# EAGLE board PP-Rev2 (EAGLE 6.5.0)
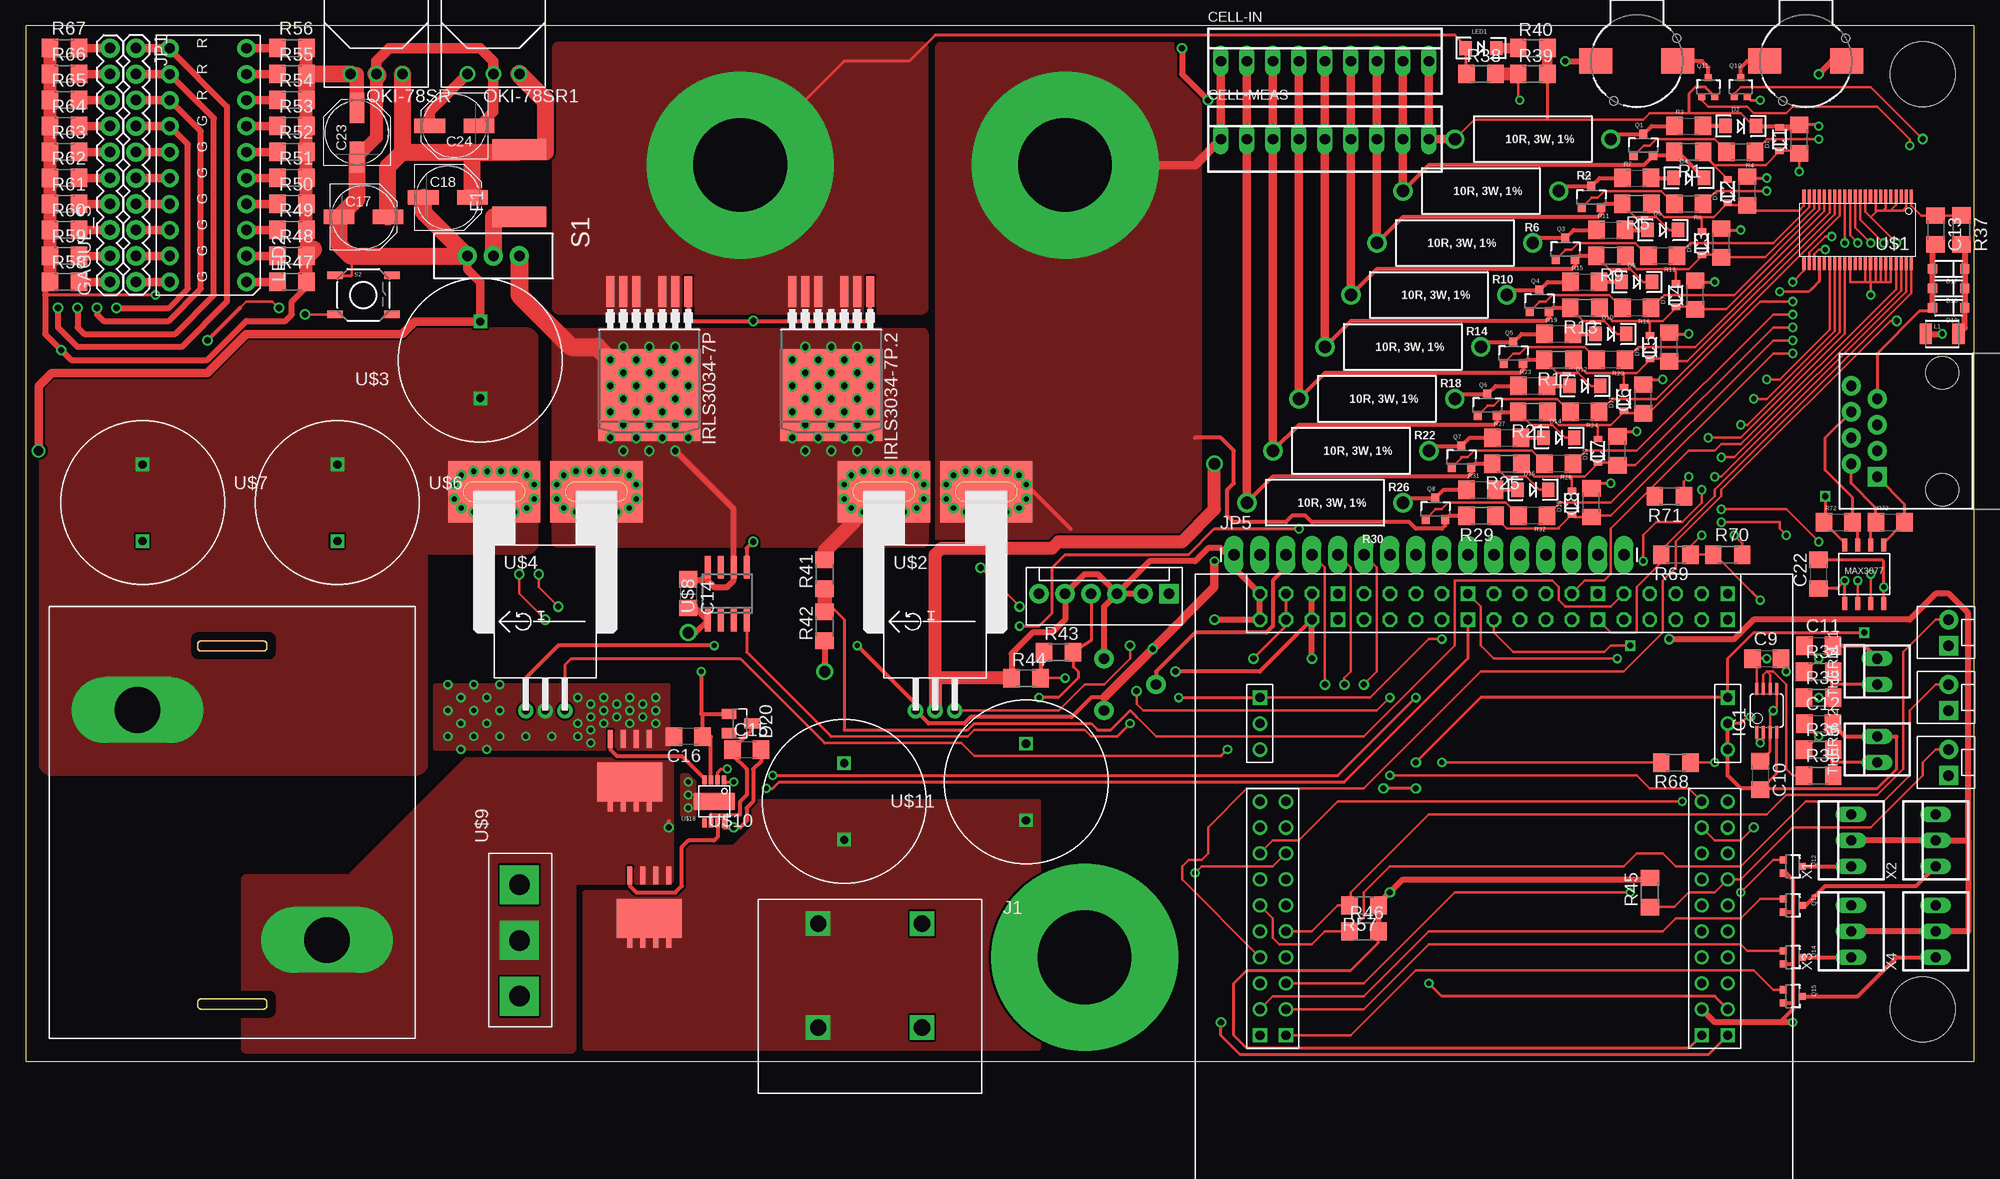
[diagram p2: board, top side]
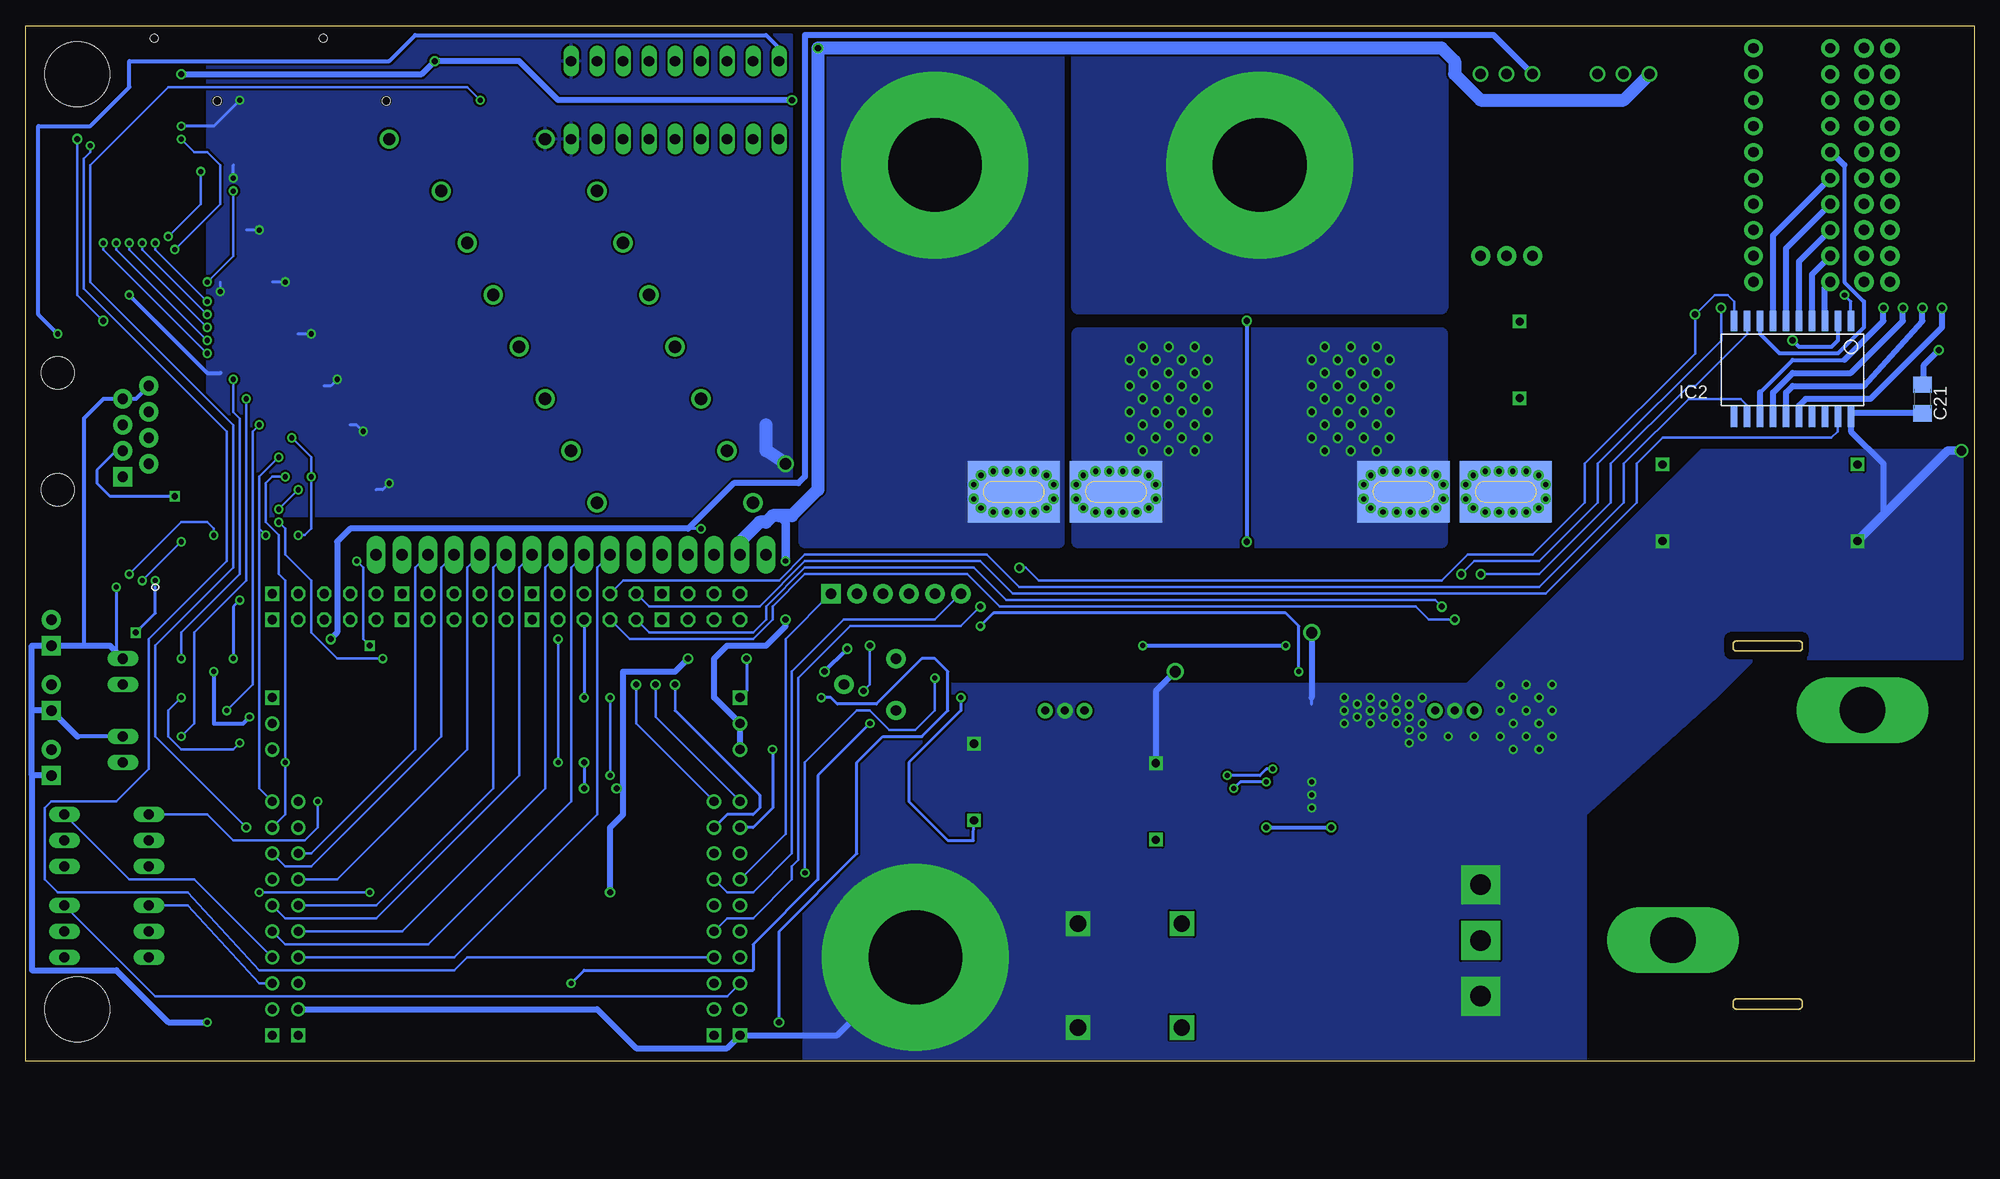
[diagram p3: board, bottom side, seen from below]

Size 190.48 x 101.27 mm. Coordinates in mm from the lower left corner, seen from the top.
Outline: 0,0 190.48,0 190.48,101.27 0,101.27 0,0
Copper layers (1*16): Top 0.035mm / dielectric 1.5mm / Bottom 0.035mm
Design rules "default *": minimum track width 10mil, minimum drill 10mil, track to track 4mil, track to pad 5mil, pad to pad 5mil, via to via 8mil, smd to smd 5mil, copper to edge 5mil, drill to drill 8mil, minimum pad ring 10mil, minimum via ring 8mil, stop-mask expansion 4mil, vias tented up to drill 0mil, thermal gap 10mil
Net classes: 0 default: clearance 0.205 mm
Holes 6.35 mm at 185.42,96.52 185.42,5.08

## Footprints (pad centres in the part's own frame; a part is rotated, then mirrored left to right if it is on the bottom)
BUZZER-CCV = smd 3.2 x 2.5: + 4,0; - -4,0 | hole 0.8: -3.9,-2.25; 2.25,3.9
C1206 = smd 1.6 x 1.8: 1 -1.4,0; 2 1.4,0
PANASONIC_D = smd 3 x 1.4: + 2.4,0; - -2.4,0
22-23-2091 = drill 1 long: 1 -10.16,0; 2 -7.62,0; 3 -5.08,0; 4 -2.54,0; 5 0,0; 6 2.54,0; 7 5.08,0; 8 7.62,0; 9 10.16,0
SOD-323 = smd 0.63 x 0.83: A 1.15,0; C -1.15,0
LED-1206 = smd 1.2 x 1.4: A -1.5,0; C 1.5,0
SOD-123 = smd 0.9 x 0.95: A 1.575,0; C -1.575,0
SOT23 = smd 1 x 1.4: 1 -0.95,-1.1; 2 0.95,-1.1; 3 0,1.1
2920 = smd 2 x 5.3: P$1 0,0; P$2 6.6,0
1X10 = drill 1.016 pad 1.88: 1 0,0; 2 2.54,0; 3 5.08,0; 4 7.62,0; 5 10.16,0; 6 12.7,0; 7 15.24,0; 8 17.78,0; 9 20.32,0; 10 22.86,0
MOLEX-1X2 = drill 1.016 pad 1.88 square: 1 0,0 | drill 1.016 pad 1.88: 2 2.54,0
MSOP08 = smd 0.3 x 1.2: 1 -0.976,-2.113; 2 -0.326,-2.113; 3 0.324,-2.113; 4 0.974,-2.113; 5 0.974,2.112; 6 0.324,2.112; 7 -0.326,2.112; 8 -0.976,2.112
SOIC-20 = smd 0.6 x 2: P$1 0,0; P$2 1.27,0; P$3 2.54,0; P$4 3.81,0; P$5 5.08,0; P$6 6.35,0; P$7 7.62,0; P$8 8.89,0; P$9 10.16,0; P$10 11.43,0; P$11 11.43,9.4; P$12 10.16,9.4; P$13 8.89,9.4; P$14 7.62,9.4; P$15 6.35,9.4; P$16 5.08,9.4; P$17 3.81,9.4; P$18 2.54,9.4; P$19 1.27,9.4; P$20 0,9.4
D2PAK-7 = smd 0.8 x 3: 1 -3.81,-9.207; 2 -2.54,-9.207; 3 -1.27,-9.207; 4 1.27,-9.207; 5 2.54,-9.207; 6 3.81,-9.207 | smd 10 x 9: PAD 0,0.895
J_2CONHC = drill 1.6 square: PIN1-1 -5.08,-3.05; PIN1-2 -5.08,7.11; PIN2-1 5.08,-3.05; PIN2-2 5.08,7.11
MOLEX-1X6 = drill 1.016 pad 1.88 square: 1 0,0 | drill 1.016 pad 1.88: 2 2.54,0; 3 5.08,0; 4 7.62,0; 5 10.16,0; 6 12.7,0
1X16_LONGPADS = drill 1.118 pad 1.88 long: 1 0,0; 2 2.54,0; 3 5.08,0; 4 7.62,0; 5 10.16,0; 6 12.7,0; 7 15.24,0; 8 17.78,0; 9 20.32,0; 10 22.86,0; 11 25.4,0; 12 27.94,0; 13 30.48,0; 14 33.02,0; 15 35.56,0; 16 38.1,0
1210 = smd 1.2 x 2: 1 -1.6,0; 2 1.6,0
LED-10 = drill 1 pad 1.778: P$1 0,0; P$2 2.54,0; P$3 5.08,0; P$4 7.62,0; P$5 10.16,0; P$6 12.7,0; P$7 15.24,0; P$8 17.78,0; P$9 20.32,0; P$10 22.86,0; P$11 22.86,7.5; P$12 20.32,7.5; P$13 17.78,7.5; P$14 15.24,7.5; P$15 12.7,7.5; P$16 10.16,7.5; P$17 7.62,7.5; P$18 5.08,7.5; P$19 2.54,7.5; P$20 0,7.5
OKI-78SRH = drill 1.016: 1 2.54,0; 2 0,0; 3 -2.54,0
SOT23-3 = smd 0.8 x 0.9: 1 -0.95,-1; 2 0.95,-1; 3 0,1.1
SOT323 = smd 0.7 x 0.7: 1 -0.65,-0.925; 2 0.65,-0.925; 3 0,0.925
R1206 = smd 1.6 x 1.803: 1 -1.422,0; 2 1.422,0
AXIAL-0.6 = drill 1.2 pad 1.88: P$1 -7.62,0; P$2 7.62,0
1206 = smd 1.6 x 1.8: 1 -1.4,0; 2 1.4,0
TRIM_POT = drill 1 pad 1.88: 1 5.08,0; 2 0,2.54; 3 0,-2.54
SWITCH-SPDT = drill 1.016 pad 1.88: 1 0,2.54; 2 0,0; 3 0,-2.54
TACTILE-SWITCH-SMD = smd 1.524 x 0.762: 1 -2.794,1.905; 2 2.794,1.905; 3 -2.794,-1.905; 4 2.794,-1.905
22-23-2021 = drill 1 long: 1 -1.27,0; 2 1.27,0
SSOP44 = smd 0.3 x 1.25: 1 -5.25,-3.3; 2 -4.75,-3.3; 3 -4.25,-3.3; 4 -3.75,-3.3; 5 -3.25,-3.3; 6 -2.75,-3.3; 7 -2.25,-3.3; 8 -1.75,-3.3; 9 -1.25,-3.3; 10 -0.75,-3.3; 11 -0.25,-3.3; 12 0.25,-3.3; 13 0.75,-3.3; 14 1.25,-3.3; 15 1.75,-3.3; 16 2.25,-3.3; 17 2.75,-3.3; 18 3.25,-3.3; 19 3.75,-3.3; 20 4.25,-3.3; 21 4.75,-3.3; 22 5.25,-3.3; 23 5.25,3.3; 24 4.75,3.3; 25 4.25,3.3; 26 3.75,3.3; 27 3.25,3.3; 28 2.75,3.3; 29 2.25,3.3; 30 1.75,3.3; 31 1.25,3.3; 32 0.75,3.3; 33 0.25,3.3; 34 -0.25,3.3; 35 -0.75,3.3; 36 -1.25,3.3; 37 -1.75,3.3; 38 -2.25,3.3; 39 -2.75,3.3; 40 -3.25,3.3; 41 -3.75,3.3; 42 -4.25,3.3; 43 -4.75,3.3; 44 -5.25,3.3
PFF_LEADFORM = drill 0.8 pad 1.5: 1 -1.91,0; 2 0,0; 3 1.91,0 | drill 0.5: 4_1 3,23.4; 4_2 4.33,23.4; 4_3 5.67,23.4; 4_4 7,23.4; 4_5 8.2,23; 4_6 8.9,22.1; 4_7 8.9,20.7; 4_8 8.2,19.8; 4_9 7,19.4; 4_10 5.67,19.4; 4_11 4.33,19.4; 4_12 3,19.4; 4_13 1.8,19.8; 4_14 1.1,20.7; 4_15 1.1,22.1; 4_16 1.8,23; 5_1 -7,23.4; 5_2 -5.67,23.4; 5_3 -4.33,23.4; 5_4 -3,23.4; 5_5 -1.8,23; 5_6 -1.1,22.1; 5_7 -1.1,20.7; 5_8 -1.8,19.8; 5_9 -3,19.4; 5_10 -4.33,19.4; 5_11 -5.67,19.4; 5_12 -7,19.4; 5_13 -8.2,19.8; 5_14 -8.9,20.7; 5_15 -8.9,22.1; 5_16 -8.2,23 | smd 9 x 6 bottom: 4_B 5,21.4; 5_B -5,21.4 | smd 9 x 6: 4_T 5,21.4; 5_T -5,21.4
C_16MM = drill 0.8 square: + 0,3.75; GND 0,-3.75
AGP4233 = drill 4.45 pad 6.452 long: P$1 27.15,10.1; P$2 8.65,32.6
SO8 = smd 0.6 x 2.2: 1 -1.905,-2.6; 2 -0.635,-2.6; 3 0.635,-2.6; 4 1.905,-2.6; 5 1.905,2.6; 6 0.635,2.6; 7 -0.635,2.6; 8 -1.905,2.6
TO-247-VERT = drill 2 pad 3.81 square: P$1 0,0; P$2 5.45,0; P$3 10.9,0
MSP432P401R-LAUNCHPAD = drill 0.9: 1.5 7.62,30.48; 1.6 53.34,33.02; 1.7 53.34,30.48; 2.3 50.8,30.48; 2.4 50.8,40.64; 2.5 53.34,43.18; 2.6 50.8,43.18; 3.0 53.34,40.64; 3.2 7.62,40.64; 3.3 7.62,38.1; 3.5 50.8,25.4; 3.6 53.34,22.86; 3.7 50.8,22.86; 4.0 10.16,38.1; 4.1 7.62,35.56; 4.2 10.16,35.56; 4.3 7.62,33.02; 4.4 10.16,33.02; 4.5 10.16,30.48; 4.6 7.62,27.94; 4.7 10.16,27.94; 5.0 53.34,27.94; 5.1 50.8,27.94; 5.2 53.34,25.4; 5.4 10.16,25.4; 5.5 10.16,22.86; 5.6 50.8,38.1; 5.7 53.34,38.1; 6.0 7.62,43.18; 6.1 10.16,40.64; 6.4 7.62,22.86; 6.5 7.62,25.4; 6.6 50.8,35.56; 6.7 50.8,33.02; GND_1 10.16,43.18; GND_3 7.62,17.78; GND_4 53.34,17.78; GND_5 7.62,15.24; GND_6 53.34,15.24; RST 53.34,35.56 | drill 0.9 square: 2.7 50.8,45.72; 3V3_1 7.62,45.72; 3V3_2 53.34,12.7; 5V_1 10.16,45.72; 5V_2 7.62,12.7; 6.2 20.32,5.08; 8.0 33.02,5.08; 8.5 7.62,5.08; 8.6 7.62,2.54; 9.3 20.32,2.54; 9.7 33.02,2.54; 10.4 45.72,5.08; 10.5 45.72,2.54; GND_2 53.34,45.72 | drill 0.9 octagon: 3V3_3 50.8,5.08; 3V3_4 50.8,2.54; 5.3 17.78,2.54; 5V_3 48.26,5.08; 5V_4 48.26,2.54; 6.3 22.86,2.54; 7.0 27.94,2.54; 7.1 25.4,5.08; 7.2 25.4,2.54; 7.3 22.86,5.08; 7.4 35.56,5.08; 7.5 35.56,2.54; 7.6 38.1,5.08; 7.7 38.1,2.54; 8.2 15.24,5.08; 8.3 15.24,2.54; 8.4 12.7,5.08; 8.7 10.16,2.54; 9.0 10.16,5.08; 9.1 12.7,2.54; 9.2 17.78,5.08; 9.4 27.94,5.08; 9.5 30.48,2.54; 9.6 30.48,5.08; 10.0 40.64,5.08; 10.1 40.64,2.54; 10.2 43.18,5.08; 10.3 43.18,2.54; GND_7 53.34,5.08; GND_8 53.34,2.54
RJ45-8 = drill 1 pad 1.88 square: 1 -4.445,6.35 | drill 1 pad 1.88: 2 -3.175,8.89; 3 -1.905,6.35; 4 -0.635,8.89; 5 0.635,6.35; 6 1.905,8.89; 7 3.175,6.35; 8 4.445,8.89 | hole 3.2: -5.715,0; 5.715,0
MAX3070E = smd 0.49 x 1.3: A -1.905,2.857; B -0.635,2.857; DI 0.635,-2.857; GND 1.905,-2.857; RO -0.635,-2.857; VCC -1.905,-2.857; Y 1.905,2.857; Z 0.635,2.857
PQFN5X6B = smd 1.75 x 0.5: P$1 -4.2,1.91; P$2 -4.2,0.64; P$3 -4.2,-0.63; P$4 -4.2,-1.9 | smd 1 x 0.5: P$5 2.375,-1.91; P$6 2.375,-0.64; P$7 2.375,0.63; P$8 2.375,1.9 | smd 3.81 x 6.35: P$9 0,0
MS8E = smd 0.442 x 0.889: P$1 -0.975,-2.106; P$2 -0.325,-2.106; P$3 0.325,-2.106; P$4 0.975,-2.106; P$5 0.975,2.106; P$6 0.325,2.106; P$7 -0.325,2.106; P$8 -0.975,2.106 | smd 4 x 1.68: P$9 0,0
LARGE_TERMINAL_HOLE = drill 9.144 pad 18.288: P$1 0,0
22-23-2031 = drill 1 long: 1 -2.54,0; 2 0,0; 3 2.54,0

## Placement (x,y rotation side)
BUZZER_1  BUZZERSMD2  [BUZZER-CCV]  157.48,97.79 180 top
BUZZER_2  BUZZERSMD2  [BUZZER-CCV]  173.99,97.79 180 top
C1  100nF  [C1206]  173.35,90.17 90 top
C2  100nF  [C1206]  168.28,85.09 90 top
C3  100nF  [C1206]  165.74,80.01 90 top
C4  100nF  [C1206]  163.19,74.93 90 top
C5  100nF  [C1206]  160.66,69.85 90 top
C6  100nF  [C1206]  158.12,64.77 90 top
C7  100nF  [C1206]  155.57,59.69 90 top
C8  100nF  [C1206]  153.03,54.61 90 top
C9  1uF  [C1206]  170.18,39.37 0 top
C10  1uF  [C1206]  169.54,27.94 270 top
C11  10nF  [C1206]  175.26,40.64 0 top
C12  10nF  [C1206]  175.26,33.02 0 top
C13  100nF  [C1206]  186.69,81.28 270 top
C14  10uF  [C1206]  64.77,45.72 270 top
C15  0.22uF  [C1206]  70.48,30.48 0 top
C16  1uF  [C1206]  64.77,31.75 180 top
C17  10uF, 63V  [PANASONIC_D]  33.02,82.55 0 top
C18  10uF, 63V  [PANASONIC_D]  41.27,84.45 0 top
C21  0.1uF  [C1206]  5.08,64.77 270 bottom
C22  1uF  [C1206]  175.26,47.62 90 top
C23  22uF  [PANASONIC_D]  32.38,90.81 90 top
C24  22uF  [PANASONIC_D]  41.91,91.44 180 top
CELL-IN  22-23-2091  [22-23-2091]  127,97.79 0 top
CELL-MEAS  22-23-2091  [22-23-2091]  127,90.17 0 top
D1  PDZ7.5B  [SOD-323]  171.45,90.17 90 top
D2  [LED-1206]  167.64,91.44 0 top
D3  PDZ7.5B  [SOD-323]  166.37,85.09 90 top
D4  [LED-1206]  162.56,86.36 0 top
D5  PDZ7.5B  [SOD-323]  163.83,80.01 90 top
D6  [LED-1206]  160.02,81.28 0 top
D7  PDZ7.5B  [SOD-323]  161.29,74.93 90 top
D8  [LED-1206]  157.48,76.2 0 top
D9  PDZ7.5B  [SOD-323]  158.75,69.85 90 top
D10  [LED-1206]  154.94,71.12 0 top
D11  PDZ7.5B  [SOD-323]  156.21,64.77 90 top
D12  [LED-1206]  152.4,66.04 0 top
D13  PDZ7.5B  [SOD-323]  153.67,59.69 90 top
D14  [LED-1206]  149.86,60.96 0 top
D15  PDZ7.5B  [SOD-323]  151.13,54.61 90 top
D16  [LED-1206]  147.32,55.88 0 top
D17  BAT46W  [SOD-123]  187.96,77.47 180 top
D18  BAT46W  [SOD-123]  187.96,75.56 180 top
D19  MMSZ5267B  [SOD-123]  187.96,73.66 180 top
D20  BAS21  [SOT23]  69.85,33.02 270 top
F1  PTC2920  [2920]  48.26,82.55 90 top
GAGUE_S  M10"  [1X10]  8.26,76.2 90 top
GAUGE_ON  M02POLAR  [MOLEX-1X2]  187.96,40.64 90 top
IC1  LT6004  [MSOP08]  170.18,34.29 0 top
IC2  TLC6C5912-Q1  [SOIC-20]  12.06,72.39 180 bottom
IRLS3034-7P  [D2PAK-7]  60.96,66.04 180 top
IRLS3034-7P.2  [D2PAK-7]  78.74,66.04 180 top
J1  J_0399700102  [J_2CONHC]  82.55,6.35 0 top
JP1  M10"  [1X10]  10.79,99.06 270 top
JP2  M02POLAR  [MOLEX-1X2]  187.96,34.29 90 top
JP3  M02POLAR  [MOLEX-1X2]  187.96,27.94 90 top
JP4  JST B6B-XH  [MOLEX-1X6]  111.76,45.72 180 top
JP5  [1X16_LONGPADS]  118.11,49.53 0 top
L1  BLM31PG330SN1L  [1210]  187.32,71.12 0 top
LED1  [LED-1206]  142.24,99.06 0 top
LED2  LED-DC7G3HWA  [LED-10]  21.59,76.2 90 top
OKI-78SR  Q_OKI-78SR5  [OKI-78SRH]  34.29,96.52 0 top
OKI-78SR1  Q_OKI-78SR12  [OKI-78SRH]  45.72,96.52 0 top
Q1  MOSFET-PCHANNEL  [SOT23-3]  158.12,89.53 0 top
Q2  MOSFET-PCHANNEL  [SOT23-3]  153.03,84.45 0 top
Q3  MOSFET-PCHANNEL  [SOT23-3]  150.5,79.38 0 top
Q4  MOSFET-PCHANNEL  [SOT23-3]  147.96,74.3 0 top
Q5  MOSFET-PCHANNEL  [SOT23-3]  145.41,69.22 0 top
Q6  MOSFET-PCHANNEL  [SOT23-3]  142.88,64.14 0 top
Q7  MOSFET-PCHANNEL  [SOT23-3]  140.34,59.05 0 top
Q8  MOSFET-PCHANNEL  [SOT23-3]  137.79,53.98 0 top
Q10  2N7002PW  [SOT323]  167.64,95.25 0 top
Q11  2N7002PW  [SOT323]  164.47,95.25 0 top
Q12  2N7002PW  [SOT323]  172.72,19.05 270 top
Q13  2N7002PW  [SOT323]  172.72,15.24 270 top
Q14  2N7002PW  [SOT323]  172.72,10.16 270 top
Q15  2N7002PW  [SOT323]  172.72,6.35 270 top
R1  100R  [R1206]  162.56,88.9 180 top
R2  10R, 3W, 1%  [AXIAL-0.6]  147.32,90.17 180 top
R3  450R  [1206]  162.56,91.44 0 top
R4  3.3k  [1206]  167.64,88.9 180 top
R5  100R  [R1206]  157.48,83.82 180 top
R6  10R, 3W, 1%  [AXIAL-0.6]  142.24,85.09 180 top
R7  450R  [1206]  157.48,86.36 0 top
R8  3.3k  [1206]  162.56,83.82 180 top
R9  100R  [R1206]  154.94,78.74 180 top
R10  10R, 3W, 1%  [AXIAL-0.6]  139.7,80.01 180 top
R11  450R  [1206]  154.94,81.28 0 top
R12  3.3k  [1206]  160.02,78.74 180 top
R13  100R  [R1206]  152.4,73.66 180 top
R14  10R, 3W, 1%  [AXIAL-0.6]  137.16,74.93 180 top
R15  450R  [1206]  152.4,76.2 0 top
R16  3.3k  [1206]  157.48,73.66 180 top
R17  100R  [R1206]  149.86,68.58 180 top
R18  10R, 3W, 1%  [AXIAL-0.6]  134.62,69.85 180 top
R19  450R  [1206]  149.86,71.12 0 top
R20  3.3k  [1206]  154.94,68.58 180 top
R21  100R  [R1206]  147.32,63.5 180 top
R22  10R, 3W, 1%  [AXIAL-0.6]  132.08,64.77 180 top
R23  450R  [1206]  147.32,66.04 0 top
R24  3.3k  [1206]  152.4,63.5 180 top
R25  100R  [R1206]  144.78,58.42 180 top
R26  10R, 3W, 1%  [AXIAL-0.6]  129.54,59.69 180 top
R27  450R  [1206]  144.78,60.96 0 top
R28  3.3k  [1206]  149.86,58.42 180 top
R29  100R  [R1206]  142.24,53.34 180 top
R30  10R, 3W, 1%  [AXIAL-0.6]  127,54.61 180 top
R31  450R  [1206]  142.24,55.88 0 top
R32  3.3k  [1206]  147.32,53.34 180 top
R33  10k, 1%  [R1206]  175.26,35.56 0 top
R34  1k  [R1206]  175.26,38.1 0 top
R35  10k, 1%  [R1206]  175.26,27.94 0 top
R36  1k  [R1206]  175.26,30.48 0 top
R37  100R  [R1206]  189.23,81.28 270 top
R38  60kΩ  [R1206]  142.24,96.52 0 top
R39  10kΩ  [R1206]  147.32,96.52 0 top
R40  5kΩ  [R1206]  147.32,99.06 0 top
R41  60kΩ  [R1206]  78.11,47.62 90 top
R42  10kΩ  [R1206]  78.11,42.55 90 top
R43  100kΩ  [R1206]  100.97,40.01 0 top
R44  10kΩ  [R1206]  97.79,37.47 0 top
R45  10kΩ  [R1206]  158.75,16.51 90 top
R46  10kΩ  [R1206]  130.81,12.7 0 top
R47  200R  [R1206]  26.04,76.2 0 top
R48  200R  [R1206]  26.04,78.74 0 top
R49  200R  [R1206]  26.04,81.28 0 top
R50  200R  [R1206]  26.04,83.82 0 top
R51  200R  [R1206]  26.04,86.36 0 top
R52  200R  [R1206]  26.04,88.9 0 top
R53  200R  [R1206]  26.04,91.44 0 top
R54  200R  [R1206]  26.04,93.98 0 top
R55  200R  [R1206]  26.04,96.52 0 top
R56  200R  [R1206]  26.04,99.06 0 top
R57  10k  [R1206]  130.81,15.24 180 top
R58  200R  [R1206]  3.81,76.2 0 top
R59  200R  [R1206]  3.81,78.74 0 top
R60  200R  [R1206]  3.81,81.28 0 top
R61  200R  [R1206]  3.81,83.82 0 top
R62  200R  [R1206]  3.81,86.36 0 top
R63  200R  [R1206]  3.81,88.9 0 top
R64  200R  [R1206]  3.81,91.44 0 top
R65  200R  [R1206]  3.81,93.98 0 top
R66  200R  [R1206]  3.81,96.52 0 top
R67  200R  [R1206]  3.81,99.06 0 top
R68  1k  [R1206]  161.29,29.21 180 top
R69  1M  [R1206]  161.29,49.53 180 top
R70  1M  [R1206]  166.37,49.53 0 top
R71  1M  [R1206]  160.66,55.24 180 top
R72  120 Ohm  [1206]  177.16,52.7 0 top
R73  120 Ohm  [1206]  182.25,52.7 0 top
RV1  [TRIM_POT]  105.41,36.83 0 top
S1  [SWITCH-SPDT]  45.72,78.74 270 top
S2  SWITCH-MOMENTARY-2SMD  [TACTILE-SWITCH-SMD]  33.02,74.93 0 top
THERM_1  22-23-2021  [22-23-2021]  180.97,38.1 90 top
THERM_2  22-23-2021  [22-23-2021]  180.97,30.48 90 top
U$1  Q_LTC6802-2  [SSOP44]  179.07,81.28 180 top
U$2  ACS770  [PFF_LEADFORM]  88.9,34.29 0 top
U$3  C_108CKH050M  [C_16MM]  44.45,68.58 180 top
U$4  ACS770  [PFF_LEADFORM]  50.8,34.29 0 top
U$5  AGP4233-223ME  [AGP4233]  38.1,44.45 180 top
U$6  C_108CKH050M  [C_16MM]  30.48,54.61 0 top
U$7  C_108CKH050M  [C_16MM]  11.43,54.61 0 top
U$8  LT1910  [SO8]  68.58,45.72 0 top
U$9  D-STTH60P03SW  [TO-247-VERT]  48.26,6.35 90 top
U$10  C_108CKH050M  [C_16MM]  80.01,25.4 180 top
U$11  C_108CKH050M  [C_16MM]  97.79,27.3 180 top
U$13  MSP432P401R-LAUNCHPAD  [MSP432P401R-LAUNCHPAD]  173.99,48.26 180 top
U$14  RJ45-8PTH  [RJ45-8]  187.32,61.59 90 top
U$15  MAX3077  [MAX3070E]  179.71,47.62 0 top
U$16  IRFH7191  [PQFN5X6B]  60.96,13.97 270 top
U$17  IRFH7191  [PQFN5X6B]  59.05,27.3 270 top
U$18  LTC4444  [MS8E]  67.31,25.4 180 top
V_ARRAY  TERMINAL_HOLE  [LARGE_TERMINAL_HOLE]  101.6,87.63 0 top
V_OUT  TERMINAL_HOLE  [LARGE_TERMINAL_HOLE]  69.85,87.63 0 top
V_OUT1  TERMINAL_HOLE  [LARGE_TERMINAL_HOLE]  103.5,10.16 0 top
X1  22-23-2031  [22-23-2031]  178.44,21.59 90 top
X2  22-23-2031  [22-23-2031]  186.69,21.59 90 top
X3  22-23-2031  [22-23-2031]  178.44,12.7 90 top
X4  22-23-2031  [22-23-2031]  186.69,12.7 90 top

## Tracks (layer width: path | path; a pad name or v marks a point on that pad's centre or on a via)
5V  (via drill 0.5, 0.6)
  Top 0.305: v12.7,74.93 1.91,74.93 | U$13.5V_1 162.56,1.27 119.38,1.27 118.11,2.54 118.11,7.62 119.38,8.89 129.54,8.89 132.23,11.58 R46.2 | v135.89,29.21 142.24,35.56 U$13.5V_2 166.37,39.37 168.91,41.91 v179.71,41.91 | v135.89,26.67 v132.72,26.67 | C22.1 177.03,46.23 v177.8,46.99 U$15.VCC | 105.41,35.56 RV1.3
  Top 0.406: U$13.5V_3 120.65,38.1 v112.39,38.1 | v81.28,40.64 86.99,34.93 U$2.1 88.26,33.02 91.76,33.02 92.39,33.66 102.23,33.66 104.14,35.56 105.41,35.56 | v67.31,40.64 52.07,40.64 48.89,37.46 U$4.1
  Top 0.61: R58.1 1.91,75.72 1.91,74.93 1.91,71.12 v3.49,69.53 4.45,68.58 17.78,68.58 21.59,72.39 25.4,72.39 26.04,73.03 26.04,74.3 27.46,75.72 R47.2 | U$13.5V_4 U$13.5V_3 v125.73,39.37 | R45.2 158.6,17.78 134.62,17.78 v133.35,16.51 132.23,15.39 R57.1 R46.2 | v113.03,99.06 113.03,96.52 v115.57,93.98 | v150.5,97.79 BUZZER_1.+ | BUZZER_2.- 176.53,97.79 v175.26,96.52
  Top 0.813: 105.41,35.56 v110.17,40.32 116.2,46.35 v116.2,48.9
  Top 1.27: R47.2 R48.2 R49.2 R50.2 R51.2 R52.2 R53.2 R54.2 27.46,95.25 | R55.2 R56.2 | R58.1 R59.1 R60.1 R61.1 R62.1 R63.1 R64.1 R65.1 R66.1 R67.1
  Top 1.422: C23.+ 32.38,96.52 OKI-78SR.3
  Top 1.676: OKI-78SR.3 R55.2 27.46,95.25
  Top 1.778: 28.09,79.38 R48.2
  Bottom 0.305: IC2.P$1 12.06,74.3 v12.7,74.93 | v135.89,29.21 v135.89,26.67 | v132.72,26.67 132.08,26.67 | v179.71,41.91 177.8,43.81 v177.8,46.99
  Bottom 0.406: v81.28,40.64 v67.31,40.64 | v112.39,38.1 v110.17,40.32
  Bottom 0.61: v3.49,69.53 4.95,68.08 4.95,66.3 C21.1 | v133.35,16.51 133.35,22.86 132.08,24.13 132.08,26.67 132.08,38.1 127,38.1 v125.73,39.37 | v115.57,93.98 138.43,93.98 142.24,97.79 v150.5,97.79 151.76,96.52 v175.26,96.52
  Bottom 0.813: v116.2,48.9 116.2,52.7 116.84,53.34
  Bottom 1.27: JP5.2 120.65,50.8 118.75,52.7 118.11,52.7 117.47,53.34 116.84,53.34 115.57,53.34 113.03,55.88 v113.03,99.06 52.07,99.06 50.8,97.79 50.8,96.52 48.26,93.98 34.29,93.98 OKI-78SR.3
+3V3  (via drill 0.5, 0.6)
  Top 0.254: R68.2 v138.43,29.21 | v138.43,41.27 137.16,41.27 131.44,35.56 U$13.3V3_2
  Top 0.305: U$13.3V3_1 164.47,0.64 118.75,0.64 116.84,2.54 v116.84,3.81 | v112.71,35.56 U$13.3V3_2 | U$13.3V3_4 U$13.3V3_3 123.19,42.55 v120.02,39.37
  Bottom 0.254: v138.43,29.21 v138.43,41.27
  Bottom 0.305: v116.84,3.81 116.84,12.7 109.22,20.32 109.22,29.21 106.68,31.75 102.87,31.75 100.33,34.29 100.33,38.1 101.6,39.37 102.87,39.37 107.31,34.92 111.12,34.92 111.76,35.56 v112.71,35.56 | v120.02,39.37 120.02,36.2 U$13.3V3_2
+12V  (via drill 0.5, 0.6)
  Top 0.305: v97.16,42.55 99.06,42.55 100.33,43.81 100.33,48.26 101.6,49.53 113.67,49.53 116.2,52.07 v124.46,52.07
  Top 0.406: v66.04,38.1 66.04,33.97 66.17,33.97 | 66.17,33.97 D20.1 | 66.17,33.97 C16.1 66.98,31.75 U$18.P$3
  Top 0.61: 189.87,21.59 189.87,43.81 187.96,45.72 186.69,45.72 184.15,43.18 168.91,43.18 167,41.27 v160.66,41.27 | X1.2 X2.2 189.87,21.59 | 189.87,21.59 189.87,12.7 X4.2 X3.2
  Top 1.016: C24.+ 39.51,92.85 OKI-78SR1.3
  Bottom 0.305: v66.04,38.1 66.04,42.55 67.31,43.81 95.89,43.81 v97.16,42.55 | v124.46,52.07 125.73,52.07
  Bottom 0.61: v160.66,41.27 160.02,41.91 160.02,50.8 158.75,52.07 125.73,52.07 121.28,56.52 114.94,56.52 114.3,57.15 114.3,100.33 46.99,100.33 OKI-78SR1.3
BMS_CSBI
  Top 0.254: U$1.44 184.32,75.1 165.1,55.88 165.1,55.24 159.87,50.01 R69.2 160.02,49.38 160.02,48.9 157.48,46.35 157.48,41.91 154.94,41.91 U$13.6.2
BMS_MISO  (via drill 0.5)
  Top 0.254: U$1.43 183.82,75.23 165.74,57.15 v165.1,57.15 | R68.1 v165.1,29.21
  Bottom 0.254: v165.1,57.15 166.37,57.15 167,56.52 167,52.7 165.74,51.44 165.74,47.62 165.1,46.99 v165.1,29.21 165.1,24.13 U$13.6.5
BMS_MOSI  (via drill 0.5)
  Top 0.254: U$1.42 183.32,75.37 167,59.05 v165.74,59.05 | R70.2 167.79,50.65 v167,51.44
  Bottom 0.254: v165.74,59.05 167.64,57.15 167.64,52.07 | 167.64,52.07 167.64,26.67 U$13.6.4 | v167,51.44 167.64,52.07
BMS_SCLK
  Top 0.254: U$1.41 182.82,75.5 167.64,60.33 165.74,60.33 165.1,59.69 162.56,59.69 158.75,55.88 | U$13.6.3 152.4,46.99 154.31,46.99 154.94,47.62 154.94,52.07 158.75,55.88 | R71.2 159.23,55.4 158.75,55.88
BMS_VREF  (via drill 0.5)
  Top 0.254: U$1.30 177.32,71.28 168.28,62.23 v167.64,62.23 | IC1.5 171.15,34.63 v170.81,34.29 170.5,33.98 IC1.3
  Top 0.305: C10.1 170.5,30.3 IC1.3
  Bottom 0.254: v167.64,62.23 168.28,61.59 168.28,36.83 v170.81,34.29
BMS_VREG  (via drill 0.5)
  Top 0.254: U$1.31 177.82,71.14 167.64,60.96 v164.47,60.96 | v163.83,51.44 162.71,50.32 R69.1 R70.1 165.1,49.53 168.78,45.85 | R71.1 162.08,56.67 v162.56,57.15 | IC1.8 169.2,38.95 C9.1
  Top 0.305: 168.78,45.85 v169.54,45.09 | v170.18,39.37 C9.1
  Bottom 0.254: v164.47,60.96 162.56,59.05 v162.56,57.15 162.56,52.07 163.19,51.44 v163.83,51.44
  Bottom 0.305: v169.54,45.09 170.18,44.45 v170.18,39.37
BUZZ_1  (via drill 0.5)
  Top 0.254: Q11.1 163.81,94 164.47,93.34 168.28,93.34 168.91,92.71 172.09,92.71 172.72,93.34 180.97,93.34 184.15,90.17 v184.15,89.53
  Bottom 0.254: v184.15,89.53 184.15,88.9 184.78,88.27 184.78,75.56 170.81,61.59 170.81,48.9 178.44,41.27 178.44,28.57 181.61,25.4 187.96,25.4 188.59,24.77 188.59,17.78 187.32,16.51 174.62,16.51 167.64,8.89 148.59,8.89 147.32,10.16 U$13.5.6
BUZZ_2  (via drill 0.6)
  Top 0.254: Q10.1 166.99,94.6 167.64,95.25 180.34,95.25 v185.42,90.17 | v182.88,72.39 182.25,72.39 165.74,55.88 165.74,55.24 161.29,50.8 161.29,48.26 160.02,46.99 160.02,41.91 156.21,38.1 142.24,38.1 130.81,26.67 119.38,26.67 115.57,22.86 115.57,20.32 114.94,19.68 113.67,19.68 113.03,19.05 113.03,17.78 U$13.5.7
  Bottom 0.254: v185.42,90.17 185.42,74.93 v182.88,72.39
CELL_1
  Top 0.406: R6.P$2 137.16,87.63 158.16,87.63 Q1.2 160.77,88.53 R1.2 161.52,88.9 D4.C
  Top 0.813: CELL-IN.8 CELL-MEAS.8 R6.P$2
CELL_1_BAL  (via drill 0.5)
  Top 0.254: U$1.25 174.82,78.94 175.26,79.38 v175.9,79.38 | v175.26,90.17 170.18,90.17 169.04,89.03 R4.1
  Bottom 0.254: v175.9,79.38 171.45,83.82 171.45,87.63 172.72,88.9 173.99,88.9 v175.26,90.17
CELL_1_FILTER  (via drill 0.5)
  Top 0.254: R1.1 163.98,88.75 164.47,88.27 | 164.47,88.27 165.1,87.63 170.06,87.63 D1.C 173.1,89.02 C1.1 v173.35,87 | D3.A 164.47,88.14 164.47,88.27 | U$1.24 174.32,79.07 175.9,80.64 v176.53,80.64
  Bottom 0.254: v176.53,80.64 173.35,83.82 v173.35,87
CELL_2
  Top 0.254: D6.C 160.66,81.28 159.38,82.55 157.33,82.55 R5.2
  Top 0.406: R5.2 154.35,83.82 Q2.2 153.99,82.86 153.67,82.55 134.62,82.55 R10.P$2
  Top 0.813: CELL-IN.7 CELL-MEAS.7 R10.P$2
CELL_2_BAL  (via drill 0.5)
  Top 0.254: U$1.23 173.82,77.3 v172.72,76.2 | v170.18,85.09 165.23,85.09 R8.1
  Bottom 0.254: v172.72,76.2 170.18,78.74 v170.18,85.09
CELL_2_FILTER
  Top 0.254: 163.83,82.55 164.98,82.55 D3.C 166.62,83.69 C2.1 168.78,83.19 173.35,83.19 173.82,83.65 U$1.22 | 163.83,82.55 160.17,82.55 R5.1 | D5.A 163.83,82.55
CELL_3
  Top 0.254: D8.C 158.12,76.2 156.84,77.47 154.79,77.47 R9.2
  Top 0.406: R9.2 151.81,78.74 Q3.2 151.44,77.78 151.13,77.47 132.08,77.47 R14.P$2
  Top 0.813: CELL-IN.6 CELL-MEAS.6 R14.P$2
CELL_3_BAL
  Top 0.254: U$1.21 174.32,83.52 170.81,80.01 162.69,80.01 R12.1
CELL_3_FILTER
  Top 0.254: 161.29,77.47 162.56,77.47 163.83,78.74 D5.C 165.49,78.86 C3.1 170.05,78.61 174.82,83.38 U$1.20 | 161.29,77.47 157.48,77.47 156.36,78.59 R9.1 | D7.A 161.29,77.47
CELL_4
  Top 0.254: D10.C 155.57,71.12 154.31,72.39 152.25,72.39 R13.2
  Top 0.406: R13.2 149.27,73.66 Q4.2 148.91,72.7 148.59,72.39 129.54,72.39 R18.P$2
  Top 0.813: CELL-IN.5 CELL-MEAS.5 R18.P$2
CELL_4_BAL
  Top 0.254: U$1.19 175.32,83.25 167,74.93 160.15,74.93 R16.1
CELL_4_FILTER
  Top 0.254: 158.75,72.39 160.02,72.39 161.29,73.66 D7.C 162.94,73.78 C4.1 166.24,73.53 175.82,83.11 U$1.18 | 158.75,72.39 155.09,72.39 R13.1 | D9.A 158.75,72.39
CELL_5
  Top 0.254: D12.C 153.03,66.04 151.76,67.31 149.71,67.31 R17.2
  Top 0.406: R17.2 146.73,68.58 Q5.2 146.37,67.62 146.05,67.31 127,67.31 R22.P$2
  Top 0.813: CELL-IN.4 CELL-MEAS.4 R22.P$2
CELL_5_BAL
  Top 0.254: U$1.17 176.32,82.97 163.19,69.85 157.61,69.85 R20.1
CELL_5_FILTER
  Top 0.254: 156.21,67.31 157.48,67.31 158.75,68.58 D9.C 160.41,68.7 C5.1 162.43,68.45 176.82,82.84 U$1.16 | 156.21,67.31 152.55,67.31 R17.1 | D11.A 156.21,67.31
CELL_6
  Top 0.254: D14.C 150.5,60.96 149.22,62.23 147.17,62.23 R21.2
  Top 0.406: R21.2 144.19,63.5 Q6.2 143.82,62.55 143.51,62.23 124.46,62.23 R26.P$2
  Top 0.813: CELL-IN.3 CELL-MEAS.3 R26.P$2
CELL_6_BAL
  Top 0.254: U$1.15 177.32,82.7 159.38,64.77 155.07,64.77 R24.1
CELL_6_FILTER  (via drill 0.5)
  Top 0.254: 153.67,62.23 154.94,62.23 156.21,63.5 D11.C 156.46,63.37 C6.1 158.25,63.5 158.75,63.5 169.54,74.3 v172.72,74.3 | 153.67,62.23 149.86,62.23 148.74,63.35 R21.1 | D13.A 153.67,62.23 | U$1.14 177.82,80.67 v177.8,80.01
  Bottom 0.254: v177.8,80.01 177.8,79.38 v172.72,74.3
CELL_7
  Top 0.254: D16.C 147.96,55.88 146.69,57.15 144.63,57.15 R25.2
  Top 0.406: R25.2 141.65,58.42 Q7.2 141.28,57.47 140.97,57.15 121.92,57.15 R30.P$2
  Top 0.813: CELL-IN.2 CELL-MEAS.2 R30.P$2
CELL_7_BAL  (via drill 0.5)
  Top 0.254: U$1.13 178.32,80.76 v179.07,80.01 | v172.72,73.03 170.81,73.03 157.48,59.69 152.53,59.69 R28.1
  Bottom 0.254: v179.07,80.01 179.07,79.38 v172.72,73.03
CELL_7_FILTER  (via drill 0.5)
  Top 0.254: 151.13,57.15 152.4,57.15 153.67,58.42 D13.C 155.32,58.54 C7.1 157.35,58.29 170.81,71.75 v172.72,71.75 | 151.13,57.15 147.47,57.15 R25.1 | D15.A 151.13,57.15 | U$1.12 178.82,81.53 v180.34,80.01
  Bottom 0.254: v180.34,80.01 180.34,79.38 v172.72,71.75
CELL_8  (via drill 0.5)
  Top 0.406: R29.2 139.11,53.34 Q8.2 138.75,52.38 138.43,52.07 135.89,52.07 135.25,52.7 125.73,52.7 125.09,53.34 123.83,53.34 123.19,52.7 118.11,52.7 117.47,53.34 117.47,55.88 118.11,56.52 118.11,59.69 116.84,60.96 114.3,60.96 | 102.12,52.07 U$2.4_6
  Top 0.61: L1.1 v187.32,71.12
  Top 0.813: CELL-IN.1 CELL-MEAS.1 114.3,87.63 V_ARRAY.P$1
  Bottom 0.406: v187.32,71.12 189.23,73.03 189.23,91.44 184.15,91.44 180.34,95.25 180.34,97.79 154.94,97.79 152.4,100.33 118.11,100.33 116.84,99.06 CELL-IN.1
  pour Top (no thermals): 114.3,50.8 89.53,50.8 89.53,99.06 114.3,99.06
  pour Bottom (no thermals): 114.3,50.8 89.53,50.8 89.53,99.06 114.3,99.06
CELL_8_BAL  (via drill 0.5)
  Top 0.254: U$1.11 179.32,82.3 v181.61,80.01 | v172.72,70.48 170.81,70.48 154.94,54.61 149.99,54.61 R32.1
  Bottom 0.254: v181.61,80.01 181.61,79.38 v172.72,70.48
CELL_8_FILTER  (via drill 0.5)
  Top 0.254: R29.1 143.66,53.19 144.78,52.07 149.86,52.07 149.86,52.19 D15.C 151.38,53.21 C8.1 153.16,53.34 154.94,53.34 170.81,69.22 v172.72,69.22 | U$1.10 179.82,83.07 180.34,82.55 | 180.34,82.55 v182.88,80.01 | U$1.8 180.82,83.03 | 180.82,83.03 180.34,82.55 | U$1.4 182.82,83.76 182.25,83.19 | 182.25,83.19 181.61,83.19 | 181.61,83.19 180.97,83.19 180.82,83.03 | U$1.2 183.82,83.49 183.51,83.19 182.25,83.19 | U$1.6 181.82,83.39 181.61,83.19
  Bottom 0.254: v182.88,80.01 182.88,79.38 v172.72,69.22
CHARGER+  (via drill 0.5)
  Top 0.305: JP4.4 104.14,41.12 R43.2 102.39,38.58 102.87,38.1 102.87,37.47 100.97,35.56 v99.06,35.56
  Bottom 0.305: v99.06,35.56 99.06,34.29 104.14,29.21 104.14,25.4 100.33,21.59 97.85,21.59 U$11.+
  pour Top (no thermals): 99.06,1.27 99.06,25.4 71.12,25.4 71.12,22.86 69.22,20.95 64.14,20.95 64.14,16.51 54.61,16.51 54.61,1.27
CHARGER_CTL_B  (via drill 0.5)
  Top 0.305: v135.89,35.56 128.27,27.94 v73.03,27.94 | U$18.P$2 67.64,28.27 67.94,28.57 v68.58,28.57
  Bottom 0.305: U$13.7.6 v135.89,35.56 | v68.58,28.57 69.22,28.57 69.85,27.94 v73.03,27.94
CHARGER_CTL_T  (via drill 0.5)
  Top 0.305: U$13.8.0 140.97,39.37 128.91,27.3 73.66,27.3 73.03,26.67 v72.39,26.67 | U$18.P$1 68.49,27.3 v69.22,27.3
  Bottom 0.305: v69.22,27.3 71.75,27.3 v72.39,26.67
CHARGER_I_MEAS  (via drill 0.5)
  Top 0.254: 78.11,31.11 91.44,31.11 92.71,29.84 116.84,29.84
  Top 0.305: 78.11,31.11 69.85,39.37 53.34,39.37 52.71,38.74 U$4.3 | 116.84,29.84 v117.47,30.48
  Bottom 0.305: v117.47,30.48 117.47,24.77 119.38,22.86 U$13.5.2
ESTOP_1
  Top 0.254: JP3.2 186.69,30.48 185.42,29.21 185.42,27.94 180.34,22.86 172.72,22.86 167.64,17.78 U$13.1.5 165.1,16.51 162.56,16.51 161.14,15.09 R45.1
ESTOP_2
  Top 0.254: JP2.2 186.69,36.83 184.15,34.29 184.15,27.94 181.61,25.4 173.99,25.4 167.64,19.05 161.29,19.05 160.02,20.32 157.48,20.32 156.21,19.05 133.35,19.05 130.81,16.51 130.81,14.12 R46.1 127,12.7 125.73,11.43 122.56,11.43 121.92,12.06 121.92,13.97 U$13.1.6
FAN_CTL_1  (via drill 0.5)
  Top 0.254: Q12.1 170.83,19.7 v167.64,16.51 | U$13.2.4 130.81,7.62 139.7,16.51 v156.84,16.51
  Bottom 0.254: v167.64,16.51 v156.84,16.51
FAN_CTL_2
  Top 0.254: Q13.1 169.56,15.89 167.64,13.97 161.29,13.97 160.02,12.7 137.16,12.7 130.81,6.35 121.92,6.35 U$13.2.5
FAN_CTL_3
  Top 0.254: Q14.1 168.26,10.81 167.64,11.43 137.16,11.43 130.81,5.08 U$13.2.6
FAN_CTL_4
  Top 0.254: Q15.1 170.8,7 168.91,8.89 135.89,8.89 129.54,2.54 U$13.2.7
FAN_TACH_1  (via drill 0.5)
  Top 0.254: v161.93,25.4 128.27,25.4 124.46,21.59 121.92,21.59 U$13.5.0
  Bottom 0.254: X1.3 172.72,24.13 170.18,21.59 163.19,21.59 161.93,22.86 v161.93,25.4
FAN_TACH_2
  Bottom 0.254: X2.3 180.34,17.78 173.99,17.78 U$13.3.3
FAN_TACH_3
  Bottom 0.254: X3.3 174.62,15.24 167.64,7.62 U$13.3.2
FAN_TACH_4
  Bottom 0.254: X4.3 177.8,6.35 121.92,6.35 U$13.3.0
GAUGE_D
  Top 0.813: JP1.7 LED2.P$17
  Bottom 0.61: IC2.P$6 18.41,79.5 LED2.P$17
GAUGE_ON  (via drill 0.6)
  Top 0.254: GAUGE_ON.2 186.69,43.18 183.51,40.01 183.51,28.57 180.97,26.04 172.09,26.04 170.18,24.13 137.16,24.13 129.54,16.51 129.54,15.39 R57.2 128.27,15.24 125.73,12.7 U$13.6.6 | S2.3 v27.3,73.03 | v97.16,44.45 v93.34,48.26
  Bottom 0.254: IC2.P$10 23.5,74.3 24.13,74.93 25.4,74.93 v27.3,73.03 27.3,69.22 38.1,58.42 38.1,54.61 43.18,49.53 49.53,49.53 52.07,46.99 91.44,46.99 92.71,48.26 v93.34,48.26 | U$13.6.6 121.92,13.97 119.38,13.97 115.57,17.78 115.57,19.05 114.94,19.68 114.94,37.47 109.86,42.55 99.06,42.55 v97.16,44.45
GND  (via drill 0.5, 0.6, 0.9, 1.1)
  Top 0.254: D2.C 168.91,91.44 167.64,92.71 162.56,92.71 158.75,92.71 158.12,92.08 148.59,92.08 141.6,92.08 R2.P$2 | 174.62,75.56 174.31,75.25 v171.45,75.25 | 181.82,76.2 182.32,76.2 U$1.40 | 181.32,76.2 180.82,76.2 | 179.82,76.2 178.32,76.2 U$1.32 | U$1.39 181.82,76.2 | U$1.38 181.32,76.2 | U$1.37 180.82,76.2 | 180.82,76.2 180.34,76.2 | U$1.36 180.32,76.2 | 180.32,76.2 180.34,76.2 | U$1.35 179.82,76.2 | 179.82,76.2 180.32,76.2 | 181.82,76.2 181.32,76.2 | 180.34,76.2 v180.34,74.93 | 31.88,76.83 31.88,78.61 31.75,78.74
  Top 0.305: R39.2 148.74,92.23 148.59,92.08 | 177.93,31.75 C12.2 | C10.2 171.15,28.15 IC1.4 | C22.2 181.48,49.02 181.61,48.9 v181.61,46.35 U$15.GND | S2.1 31.88,76.83 | Q11.2 164.19,95.25 163.19,95.25 162.56,94.61 162.56,92.71 | Q10.2 168.63,93.98 v169.54,93.98 | v175.26,91.44 175.13,91.57 C1.2 | C2.2 168.41,86.36 v170.18,86.36 | C3.2 165.87,81.28 v167.64,81.28 | C4.2 163.32,76.2 v165.1,76.2 | C5.2 160.78,71.12 v162.56,71.12 | C6.2 158.62,66.67 v160.02,66.67 | C7.2 156.08,61.59 v157.48,61.59 | C8.2 153.54,56.52 v154.94,56.52 | 167.64,26.67 180.97,26.67 182.88,28.57 182.88,31.75 | U$1.26 175.32,76.26 174.62,75.56 | D17.A 186.37,77.46 186.37,73.66 186.06,73.34 185.1,73.34 180.97,69.22 U$14.7 | v168.59,33.66 168.28,33.66 167.64,33.02 U$13.GND_5
  Top 0.406: D2.C 171.33,91.44 D1.A | Q12.2 172.1,18.4 172.72,17.78 172.72,14.61 | 172.72,14.61 172.72,9.53 | 172.72,9.53 172.72,5.71 | 172.72,5.71 172.72,5.08 171.45,3.81 165.1,3.81 | Q15.2 171.81,5.71 172.72,5.71 | Q14.2 171.81,9.53 172.72,9.53 | Q13.2 171.81,14.61 172.72,14.61 | C9.2 172.09,38.87 v172.09,38.1 | C10.2 169.41,26.67 167.64,26.67 166.37,27.94 U$13.GND_3 U$13.GND_5 | C11.2 179.71,40.64 THERM_1.2 | C12.2 176.66,32.89 177.8,31.75 THERM_2.2 182.88,31.75
  Top 0.61: D19.A D18.A D17.A 186.38,79.58 C13.2 | D1.A 173.1,91.32 C1.2 | R44.1 96.37,39.85 98.42,41.91 100.33,41.91 101.6,43.18 JP4.5 103.5,47.62 104.78,47.62 JP4.3 | JP4.3 JP4.2 | RV1.2 105.41,44.45 JP4.3 | JP4.3 109.86,48.9 114.3,48.9 115.57,50.16 116.84,50.16 117.47,49.53 JP5.1 118.11,48.26 U$13.GND_8 U$13.GND_7 v116.2,43.18 | C14.2 65.47,44.32 U$8.1 65.47,41.91 v64.77,41.91 | R42.1 v78.11,38.1 | U$13.GND_1 165.1,3.81 v172.72,3.81
  Top 0.813: R2.P$2 CELL-MEAS.9 CELL-IN.9 | v1.27,59.69 1.27,66.04 2.54,67.31 17.78,67.31 21.59,71.12 36.83,71.12 38.04,72.33 U$3.GND 44.45,76.2 43.18,77.47 S1.3
  Top 1.016: R40.2 R39.2 | OKI-78SR.2 34.29,97.79 35.56,99.06 44.45,99.06 45.72,97.79 OKI-78SR1.2 45.72,92.85 C24.-
  Top 1.27: R44.1 88.9,37.47 | 88.9,37.47 U$2.2 | 88.9,37.47 88.9,49.53 89.53,50.16 100.33,50.16 100.97,50.8 113.03,50.8 116.2,53.98 v116.2,58.42 | 34.42,96.39 34.29,96.26 34.29,90.31 C23.-
  Top 1.676: C18.- 38.88,83.05 S1.3 31.75,78.74 30.62,79.87 C17.- 32.38,84.31 C23.-
  Top 1.778: OKI-78SR.2 34.42,96.39
  Bottom 0.254: v171.45,75.25 171.45,76.2 | 180.34,64.77 U$14.7
  Bottom 0.305: v169.54,93.98 172.09,91.44 v175.26,91.44 | v170.18,86.36 170.18,87.63 | v167.64,81.28 168.91,81.28 | v165.1,76.2 166.37,76.2 | v162.56,71.12 163.83,71.12 | v160.02,66.67 160.66,66.04 161.29,66.04 | v157.48,61.59 158.12,62.23 158.75,62.23 | v154.94,56.52 155.57,55.88 156.21,55.88 | v181.61,46.35 181.61,40.01 | 64.77,34.92 64.77,35.56
  Bottom 0.406: v172.09,38.1 172.09,33.02 169.23,33.02 v168.59,33.66 | THERM_2.2 185.42,31.75 | U$14.8 179.71,64.77 U$14.7 182.88,64.77 184.78,62.87 184.78,40.64 | v180.34,74.93 172.72,67.31 171.45,67.31
  Bottom 0.61: C21.2 12.06,63.37 IC2.P$20 12.06,61.59 8.89,58.42 8.89,53.4 U$7.GND | U$13.GND_4 U$13.GND_6 123.19,35.56 123.19,39.37 121.92,40.64 118.11,40.64 116.2,42.55 v116.2,43.18 | v64.77,41.91 64.77,35.56 | v78.11,38.1 80.01,36.2 U$10.GND | V_OUT1.P$1 111.12,2.54 U$13.GND_2 121.92,1.27 130.81,1.27 134.62,5.08 U$13.GND_1 | 189.87,27.94 189.87,8.89 181.61,8.89 176.53,3.81 v172.72,3.81 | JP3.1 189.87,27.94 | 189.87,27.94 189.87,34.29 | 189.87,34.29 JP2.1 185.42,31.75 | 189.87,34.29 189.87,40.64 GAUGE_ON.1 184.78,40.64 182.25,40.64 181.61,40.01 THERM_1.2
  Bottom 0.813: v1.27,59.69 2.6,59.69 U$7.GND
  Bottom 1.27: v116.2,58.42 118.11,59.69 118.11,62.23
  other vias: 61.59,33.02 61.59,33.02 61.59,35.56 61.59,34.29 60.33,34.92 60.33,33.66 59.05,33.02 59.05,34.29 59.05,35.56 56.52,35.56 57.78,34.92 57.78,33.66 56.52,34.29 56.52,33.02 55.24,34.92 55.24,33.66 55.24,32.38 55.24,31.11 53.98,35.56 53.98,33.02 53.98,31.75 51.44,31.75 48.9,31.75 46.35,31.75 46.35,34.29 46.35,36.83 45.09,33.02 45.09,35.56 45.09,30.48 43.81,36.83 43.81,34.29 43.81,31.75 42.55,35.56 42.55,33.02 42.55,30.48 41.27,34.29 41.27,31.75 41.27,36.83 64.77,26.04 64.77,24.77 64.77,27.3
  pour Bottom (no thermals): 114.3,0 114.3,24.13 101.6,36.83 49.53,36.83 26.67,59.69 1.27,59.69 1.27,39.37 21.59,39.37 25.4,35.56 38.1,24.13 38.1,0
  pour Bottom: 115.57,54.61 115.57,100.33 172.72,100.33 172.72,53.34 115.57,53.34
  pour Top (no thermals): 62.87,36.83 62.87,30.48 40.01,30.48 40.01,36.83
  pour Top (no thermals): 65.41,24.13 65.41,27.3 64.77,27.94 64.14,27.94 64.14,24.13
LCD_DB[0]
  Bottom 0.254: U$13.4.0 148.59,10.16 134.62,24.13 134.62,48.26 JP5.7
LCD_DB[1]
  Bottom 0.254: U$13.4.1 165.1,11.43 151.13,11.43 137.16,25.4 137.16,48.26 JP5.8
LCD_DB[2]
  Bottom 0.254: U$13.4.2 153.67,12.7 139.7,26.67 139.7,48.26 JP5.9
LCD_DB[3]
  Bottom 0.254: U$13.4.3 165.1,13.97 156.21,13.97 142.24,27.94 142.24,48.26 JP5.10
LCD_DB[4]
  Bottom 0.254: U$13.4.4 156.21,15.24 144.78,26.67 144.78,48.26 JP5.11
LCD_DB[5]
  Bottom 0.254: U$13.4.5 160.02,17.78 147.32,30.48 147.32,48.26 JP5.12
LCD_DB[6]
  Bottom 0.254: U$13.4.6 165.1,19.05 162.56,19.05 149.86,31.75 149.86,48.26 JP5.13
LCD_DB[7]
  Bottom 0.254: U$13.4.7 162.56,20.32 152.4,30.48 152.4,48.26 JP5.14
LCD_EN  (via drill 0.6)
  Top 0.254: JP5.6 132.08,48.26 132.08,38.1 v130.81,36.83
  Bottom 0.254: v130.81,36.83 130.81,33.02 U$13.3.7
LCD_RS  (via drill 0.6)
  Top 0.254: v127,36.83 127,48.26 JP5.4
  Bottom 0.254: 127,34.29 v127,36.83
  Bottom 0.305: 127,34.29 118.75,26.04 118.75,24.77 119.38,24.13 121.92,24.13 U$13.3.5
LCD_RW  (via drill 0.6)
  Top 0.254: JP5.5 129.54,48.26 129.54,38.1 128.91,37.47 v128.91,36.83
  Bottom 0.254: v128.91,36.83 128.91,33.66 U$13.3.6
LCD_VBACK
  Top 0.406: JP5.3 123.19,48.26 121.92,46.99 121.92,42.55 121.28,41.91 114.3,41.91 110.49,38.1 RV1.1
LED_CLR  (via drill 0.6)
  Top 0.254: v48.26,47.62 48.26,45.72 v50.8,43.18
  Bottom 0.254: U$13.10.0 131.44,41.27 119.38,41.27 117.47,43.18 117.47,44.45 114.3,47.62 98.42,47.62 95.25,44.45 54.61,44.45 53.34,43.18 v50.8,43.18 | IC2.P$9 22.23,71.12 27.3,66.04 27.94,66.04 35.56,58.42 35.56,54.61 42.55,47.62 v48.26,47.62
LED_RCK
  Bottom 0.254: U$13.10.1 132.08,46.99 116.84,46.99 114.3,49.53 96.52,49.53 93.34,46.35 42.55,46.35 34.29,54.61 34.29,58.42 27.94,64.77 22.86,64.77 22.23,64.14 IC2.P$12
LED_SER_IN  (via drill 0.6)
  Top 0.254: v52.07,44.45 50.16,46.35 v50.16,47.62 | v24.77,73.66 24.13,74.3 21.59,74.3 20.95,73.66
  Top 0.406: v17.78,70.48 20.95,73.66
  Bottom 0.254: U$13.10.2 129.54,41.91 119.38,41.91 118.11,43.18 118.11,44.45 114.3,48.26 97.79,48.26 94.61,45.09 52.7,45.09 v52.07,44.45 | v50.16,47.62 48.9,48.9 42.55,48.9 36.83,54.61 36.83,58.42 24.77,70.48 v24.77,73.66
  Bottom 0.406: IC2.P$2 13.34,70.48 13.97,69.85 17.14,69.85 v17.78,70.48
LED_SRCK
  Bottom 0.254: U$13.10.3 129.54,44.45 118.75,44.45 114.3,48.9 97.16,48.9 93.98,45.72 41.91,45.72 33.02,54.61 33.02,58.42 30.48,60.96 13.97,60.96 13.34,61.59 IC2.P$19
LOGIC_POWER
  Top 1.676: OKI-78SR.1 36.83,91.44 36.83,88.9 | 36.83,88.9 43.18,88.9 | 43.18,88.9 48.26,88.9 | 48.26,88.9 F1.P$2 | 50.8,93.98 50.8,88.9 48.26,88.9 | C17.+ 35.42,87.49 36.83,88.9 | C18.+ 43.67,88.41 43.18,88.9
  Top 1.778: OKI-78SR1.1 50.8,93.98
N$1
  Top 0.406: R10.P$1 147.78,80.47 Q3.3 151.3,81.28 R11.1
N$2
  Top 0.406: R2.P$1 155.41,90.64 Q1.3 158.92,91.44 R3.1
N$3
  Top 0.406: D2.A R3.2
N$4
  Top 0.406: R11.2 D6.A
N$5
  Top 0.254: Q1.1 158.16,89.53 158.75,89.53 159.38,90.17 165.1,90.17 166.24,89.03 R4.2
N$6
  Top 0.254: Q3.1 150.5,79.33 150.5,79.38 151.13,79.38 151.76,80.01 157.35,80.01 R12.2
N$7
  Top 0.406: R6.P$1 150.32,85.56 Q2.3 153.84,86.36 R7.1
N$8
  Top 0.406: R7.2 D4.A
N$9
  Top 0.254: Q2.1 153.03,84.41 153.03,84.45 153.67,84.45 154.31,85.09 159.89,85.09 R8.2
N$10
  Top 0.406: R14.P$1 145.25,75.39 Q4.3 148.76,76.2 R15.1
N$11
  Top 0.406: D8.A R15.2
N$12
  Top 0.254: R16.2 154.81,74.93 149.22,74.93 148.59,74.3 147.96,74.3 147.96,74.25 Q4.1
N$13
  Top 0.406: R18.P$1 142.71,70.31 Q5.3 146.22,71.12 R19.1
N$14
  Top 0.406: R19.2 D10.A
N$15
  Top 0.254: R20.2 153.54,68.71 152.4,69.85 146.69,69.85 146.05,69.22 145.41,69.22 144.47,68.27 Q5.1
N$16
  Top 0.406: R22.P$1 140.16,65.23 Q6.3 143.68,66.04 R23.1
N$17
  Top 0.406: R23.2 D12.A
N$18
  Top 0.254: Q6.1 142.88,64.08 142.88,64.14 143.51,64.14 144.15,64.77 149.73,64.77 R24.2
N$19
  Top 0.406: R26.P$1 137.62,60.16 Q7.3 141.14,60.96 R27.1
N$20
  Top 0.406: R27.2 D14.A
N$21
  Top 0.254: Q7.1 140.34,59.01 140.34,59.05 140.97,59.05 141.6,59.69 147.19,59.69 R28.2
N$22
  Top 0.406: R30.P$1 135.09,55.08 Q8.3 138.6,55.88 R31.1
N$23
  Top 0.406: R31.2 D16.A
N$24
  Top 0.254: Q8.1 137.79,53.92 137.79,53.98 138.43,53.98 139.06,54.61 144.65,54.61 R32.2
N$25  (via drill 0.5)
  Top 0.254: R33.1 v175.26,35.56 | IC1.2 169.85,31.42 v169.54,31.11 169.2,31.46 IC1.1
  Bottom 0.254: v175.26,35.56 176.53,34.29 176.53,31.75 175.26,30.48 170.18,30.48 v169.54,31.11
N$26
  Top 0.61: R37.2 189.53,79.55 D17.C D18.C D19.C 189.53,71.73 L1.2
N$27
  Top 0.254: R35.1 172.72,27.94 172.09,28.57 172.09,36.83 170.81,38.1 170.18,38.1 | 170.18,38.1 169.85,37.77 IC1.7 | IC1.6 170.5,37.78 170.18,38.1
N$28
  pour Top (no thermals): 2.54,29.21 38.1,29.21 38.1,50.8 48.9,50.8 48.9,70.48 2.54,70.48
N$29
  Top 0.305: THERM_1.1 176.53,36.83 | 176.53,36.83 176.53,35.71 R33.2 | 176.53,36.83 176.53,37.95 R34.2
N$30
  Top 0.305: THERM_2.1 176.53,29.21 176.53,30.33 R36.2 R35.2
N$31
  Top 0.254: U$1.1 184.32,83.65 185.29,82.68 C13.1 186.71,82.7 R37.1
N$32
  Top 0.813: JP1.10 LED2.P$20
  Bottom 0.61: IC2.P$3 14.61,75.69 LED2.P$20
N$34  (via drill 0.6)
  Top 0.406: IRLS3034-7P.1 64.77,72.39 v71.12,72.39 82.55,72.39 IRLS3034-7P.2.1 | v71.12,50.8 70.48,50.16 U$8.5
  Bottom 0.406: v71.12,72.39 v71.12,50.8
N$35
  Top 0.305: U$15.Y 181.61,50.67 R73.2 183.65,54.48 U$14.1
N$36
  Top 1.016: LED1.C R40.1
N$37
  Top 0.305: LED1.A 140.82,98.98 R38.1 140.82,99.21 139.7,100.33 88.9,100.33 86.36,97.79 80.01,97.79 V_OUT.P$1
  pour Top (no thermals): 52.07,73.66 87.63,73.66 87.63,99.06 52.07,99.06
  pour Bottom (no thermals): 52.07,73.66 87.63,73.66 87.63,99.06 52.07,99.06
N$38
  Top 0.305: 66.98,24.13 69.85,24.13
  Top 0.406: U$18.P$6 66.98,24.13 | 69.85,24.13 69.85,25.4 70.48,26.04 70.48,28.57 69.08,29.98 C15.1 70.95,32.34 D20.3
N$39  (via drill 0.6)
  Top 0.406: U$18.P$8 68.28,22.86 v69.22,22.86 69.85,22.86 70.48,23.5 70.48,24.77 71.12,25.4 71.12,28.57 71.89,29.34 C15.2 | v62.87,22.86 62.87,23.5
  Bottom 0.406: v69.22,22.86 v62.87,22.86
  pour Top (no thermals): 62.87,17.78 62.87,29.21 43.18,29.21 31.75,17.78 21.59,17.78 21.59,1.27 53.34,1.27 53.34,17.78
N$40
  Top 0.406: U$16.P$4 59.06,17.14 59.69,16.51 63.5,16.51 64.14,17.14 64.14,20.95 64.77,21.59 67.31,21.59 67.64,21.91 U$18.P$7
N$41  (via drill 0.6)
  Top 0.61: C14.1 64.9,46.99 66.04,46.99 66.67,47.62 U$8.8 66.67,46.99 67.31,46.35 68.58,46.35 69.22,46.99 U$8.6 69.22,53.98 v63.5,59.69
  Top 1.422: R41.2 78.11,49.9 U$2.5_T
  Top 1.778: S1.1 48.26,74.93 53.34,69.85 55.88,69.85 v57.15,68.58
  other vias: 58.42,69.85 60.96,69.85 63.5,69.85 64.77,68.58 62.23,68.58 59.69,68.58 58.42,67.31 60.96,67.31 63.5,67.31 64.77,66.04 62.23,66.04 59.69,66.04 57.15,66.04 58.42,64.77 60.96,64.77 63.5,64.77 64.77,63.5 62.23,63.5 59.69,63.5 57.15,63.5 58.42,62.23 60.96,62.23 63.5,62.23 64.77,60.96 62.23,60.96 59.69,60.96 57.15,60.96 58.42,59.69 60.96,59.69 76.2,69.85 78.74,69.85 81.28,69.85 82.55,68.58 80.01,68.58 77.47,68.58 74.93,68.58 76.2,67.31 78.74,67.31 81.28,67.31 82.55,66.04 80.01,66.04 77.47,66.04 74.93,66.04 76.2,64.77 78.74,64.77 81.28,64.77 82.55,63.5 80.01,63.5 77.47,63.5 74.93,63.5 76.2,62.23 78.74,62.23 81.28,62.23 82.55,60.96 80.01,60.96 77.47,60.96 74.93,60.96 76.2,59.69 78.74,59.69 81.28,59.69
  pour Top (no thermals): 52.07,50.8 52.07,71.12 87.63,71.12 87.63,50.8
  pour Bottom (no thermals): 52.07,50.8 52.07,71.12 87.63,71.12 87.63,50.8
N$42
  Top 1.676: F1.P$1 45.72,82.55 S1.2
N$43
  Top 0.813: JP1.9 LED2.P$19
  Bottom 0.61: IC2.P$4 15.88,76.95 LED2.P$19
N$44
  Top 0.813: JP1.8 LED2.P$18
  Bottom 0.61: IC2.P$5 17.14,78.22 LED2.P$18
N$45
  Top 0.305: U$15.Z 180.34,52.2 R73.1 180.84,54.1 178.44,56.52 U$14.2
N$46
  Top 0.813: JP1.6 LED2.P$16
  Bottom 0.61: IC2.P$7 19.68,80.77 LED2.P$16
N$47
  Top 0.813: JP1.5 LED2.P$15
  Bottom 0.406: 12.7,87.63 12.7,76.2 10.79,74.3 10.79,71.75 13.34,69.22 19.05,69.22 20.95,71.12 IC2.P$8
  Bottom 0.61: LED2.P$15 13.97,88.9 12.7,87.63
N$48  (via drill 0.6)
  Top 0.61: v8.89,73.66 13.97,73.66 15.88,75.56 15.88,89.66 LED2.P$14
  Top 0.813: JP1.4 LED2.P$14
  Bottom 0.406: 20.95,65.41 17.78,68.58 12.7,68.58
  Bottom 0.61: IC2.P$13 20.95,65.41 | 12.7,68.58 8.89,72.39 v8.89,73.66
N$49  (via drill 0.6)
  Top 0.61: v6.99,73.66 6.99,73.03 7.62,72.39 13.97,72.39 17.14,75.56 17.14,90.92 LED2.P$13
  Top 0.813: JP1.3 LED2.P$13
  Bottom 0.61: IC2.P$14 19.68,65.41 17.78,67.31 12.06,67.31 6.99,72.39 v6.99,73.66
N$50  (via drill 0.6)
  Top 0.61: v5.08,73.66 5.08,71.75 5.71,71.12 14.61,71.12 18.41,74.93 18.41,92.19 LED2.P$12
  Top 0.813: LED2.P$12 JP1.2
  Bottom 0.61: IC2.P$15 18.41,65.41 17.78,66.04 10.79,66.04 5.08,72.39 v5.08,73.66
N$51  (via drill 0.6)
  Top 0.61: LED2.P$11 14.09,98.94 19.68,93.34 19.68,74.3 15.24,69.85 5.08,69.85 3.17,71.75 v3.17,73.66
  Top 0.813: LED2.P$11 JP1.1
  Bottom 0.61: v3.17,73.66 3.17,71.75 10.16,64.77 16.51,64.77 17.14,64.14 IC2.P$16
N$52
  Top 0.813: LED2.P$1 R47.1
N$53
  Top 0.813: LED2.P$2 R48.1
N$54
  Top 0.813: LED2.P$3 R49.1
N$55
  Top 0.813: LED2.P$4 R50.1
N$56
  Top 0.813: LED2.P$5 R51.1
N$57
  Top 0.813: LED2.P$6 R52.1
N$58
  Top 0.813: LED2.P$7 R53.1
N$59
  Top 0.813: LED2.P$8 R54.1
N$60
  Top 0.813: LED2.P$9 R55.1
N$61
  Top 0.813: LED2.P$10 R56.1
N$62
  Top 0.305: U$15.B 179.07,52.2 R72.2 178.56,55.12 175.9,57.78 175.9,60.96 U$14.6
N$63
  Top 0.406: Q11.3 164.47,97.16 163.83,97.79 BUZZER_1.-
N$64
  Top 0.406: Q10.3 167.64,97.16 168.28,97.79 BUZZER_2.+
N$65
  Top 0.406: U$17.P$4 57.16,30.48 57.15,30.48 57.78,29.84 64.14,29.84 66.33,27.64 U$18.P$4
N$66
  Top 0.406: Q12.3 X1.1
N$67  (via drill 0.6)
  Top 0.305: U$15.A 177.8,50.67 R72.1 175.9,52.84 v175.9,55.24
  Bottom 0.305: U$14.3 181.61,59.69 183.51,57.78 183.51,56.52 182.25,55.24 v175.9,55.24
N$70
  Top 0.406: Q13.3 173.99,15.24 175.9,17.14 184.78,17.14 X2.1
N$71
  Top 0.406: Q14.3 X3.1
N$72
  Top 0.406: Q15.3 179.07,6.35 182.88,10.16 X4.1
N$75
  Top 0.813: GAGUE_S.1 R58.2
N$76
  Top 0.813: GAGUE_S.2 R59.2
N$77
  Top 0.813: GAGUE_S.3 R60.2
N$78
  Top 0.813: GAGUE_S.4 R61.2
N$79
  Top 0.813: GAGUE_S.5 R62.2
N$80
  Top 0.813: GAGUE_S.6 R63.2
N$81
  Top 0.813: GAGUE_S.7 R64.2
N$82
  Top 0.813: GAGUE_S.8 R65.2
N$83
  Top 0.813: GAGUE_S.9 R66.2
N$84
  Top 0.813: GAGUE_S.10 R67.2
PACK_GATE  (via drill 0.5)
  Top 0.254: 78.74,31.75 92.08,31.75 92.71,32.38 103.5,32.38 104.14,31.75 106.68,31.75
  Top 0.305: U$8.4 70.48,40.01 78.74,31.75 | U$13.6.0 165.1,6.35 138.43,6.35 v137.16,7.62 | 106.68,31.75 v107.95,33.02
  Bottom 0.305: v137.16,7.62 135.89,8.89 119.38,8.89 119.38,11.43 113.03,17.78 113.03,27.94 v107.95,33.02
PACK_I_MEAS  (via drill 0.5, 0.6)
  Top 0.254: U$2.3 100.97,34.29 103.5,36.83 105.41,36.83 107.95,39.37 v107.95,40.64 | v133.35,35.56 132.08,34.29 109.22,34.29 108.58,34.92 v108.58,36.2 | v133.35,27.94 157.48,27.94 158.75,26.67 162.56,26.67 U$13.5.5
  Bottom 0.254: v133.35,35.56 v133.35,27.94 | v108.58,36.2 107.95,36.83 v107.95,40.64
SER_IN  (via drill 0.5, 0.6)
  Top 0.254: U$13.9.6 143.51,41.91 145.41,40.01 154.31,40.01 154.94,40.64 v156.84,40.64 | v158.12,48.9 158.12,51.44 159.38,52.7 161.93,52.7 163.83,54.61 v163.83,55.88 | v165.74,53.98 172.09,53.98 v175.26,50.8 | v179.07,46.99 U$15.RO
  Bottom 0.254: v156.84,40.64 157.48,41.27 157.48,48.26 v158.12,48.9 | v163.83,55.88 v165.74,53.98 | v175.26,50.8 v179.07,46.99
SER_OUT  (via drill 0.5)
  Top 0.254: U$13.9.7 142.24,44.45 142.24,40.64 143.51,39.37 v155.57,39.37 | v165.74,52.7 171.45,52.7 171.45,52.07 v172.09,51.44 | U$15.DI v180.34,47.62
  Bottom 0.254: v155.57,39.37 160.02,39.37 162.56,41.91 162.56,46.99 165.1,49.53 165.1,52.07 v165.74,52.7 | v180.34,47.62 175.26,52.7 172.72,52.7 172.09,52.07 v172.09,51.44
SUPPLY_CTL
  Bottom 0.254: U$13.2.3 121.92,16.51 119.38,16.51 115.57,20.32 115.57,38.1 110.49,43.18 101.6,43.18 JP4.6
SUPPLY_DC_OK
  Bottom 0.254: U$13.1.7 116.2,22.23 116.2,41.27 JP4.1
TEMP_1  (via drill 0.5)
  Top 0.254: U$1.28 176.32,71.55 171.45,66.67 v170.18,66.67 | C11.1 175.13,39.37 v175.26,39.37 173.99,38.1 R34.1
  Bottom 0.254: v170.18,66.67 170.18,63.5 169.54,62.87 169.54,47.62 175.26,41.91 v175.26,39.37
TEMP_2  (via drill 0.5)
  Top 0.254: U$1.29 176.82,71.41 170.18,64.77 v168.91,64.77 | C12.1 175.13,31.75 v175.26,31.75 173.99,30.48 R36.1
  Bottom 0.254: v168.91,64.77 168.91,46.99 173.99,41.91 173.99,33.02 v175.26,31.75
V_CHECK_ARRAY
  Top 0.254: U$13.5.3 154.94,44.45 150.5,44.45 149.86,45.09 149.86,46.35 149.22,46.99 139.7,46.99 139.7,40.64 130.81,31.75 110.49,31.75 107.95,34.29
  Top 0.305: R41.1 78.11,45.09 80.01,43.18 80.01,32.38 92.08,32.38 92.71,33.02 104.14,33.02 104.78,32.38 106.05,32.38 107.95,34.29 108.58,33.66
  Top 1.422: R41.1 R42.2
V_CHECK_CHARGER_IN  (via drill 0.5)
  Top 0.254: U$13.5.1 121.92,19.05 114.94,19.05 v114.3,18.41 | v101.6,37.47 R44.2
  Top 0.406: R43.1 99.21,39.67 R44.2
  Bottom 0.254: v114.3,18.41 114.3,29.21 109.22,34.29 107.95,34.29 106.05,32.38 103.5,32.38 101.6,34.29 v101.6,37.47
V_CHECK_OUT  (via drill 0.5, 0.6)
  Top 0.254: R39.1 145.9,94.13 v146.05,93.98 | U$13.5.4 165.1,21.59 167.64,21.59 v168.91,22.86
  Top 1.27: R39.1 R38.2
  Bottom 0.254: v146.05,93.98 147.32,95.25 176.53,95.25 184.15,87.63 184.15,76.2 170.18,62.23 170.18,48.26 177.8,40.64 177.8,31.75 v168.91,22.86